# Altium schematic sheet ICM-20948.SchDoc
size A; SheetNumber: 6; SheetTotal: 6
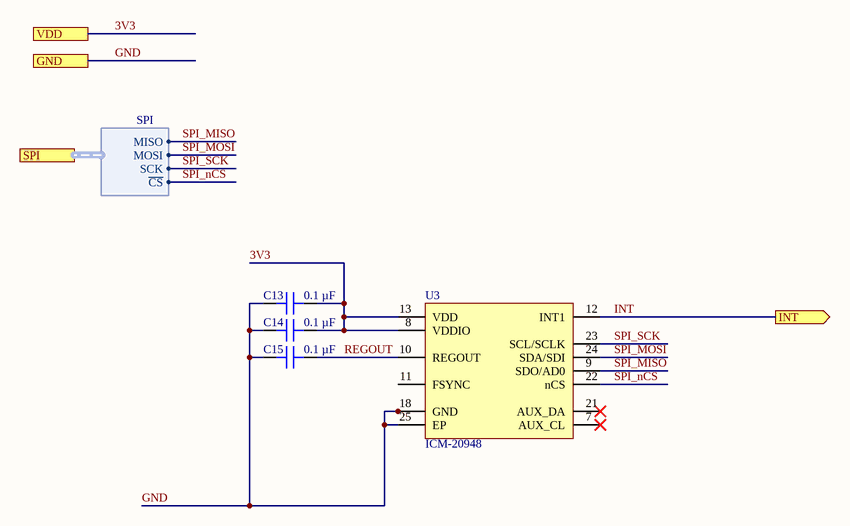
[diagram p0: ICM-20948.SchDoc]

## Parts
C13  0.1 µF  [CAP 0402_1005]
C14  0.1 µF  [CAP 0402_1005]
C15  0.1 µF  [CAP 0402_1005]
U3  ICM-20948  [ICM-20948]

## Ports
GND, INT (out), SPI (harness SPI), VDD

## Harnesses
SPI: MISO, SCK, MOSI, ~{CS}

## Nets
3V3: C13.1 C14.1 U3.8(VDDIO) U3.13(VDD) ; port VDD
GND: C13.2 C14.2 C15.2 U3.18(GND) U3.20(GND) U3.25(EP) ; port GND
INT: U3.12(INT1) ; port INT
REGOUT: C15.1 U3.10(REGOUT)
SPI_MISO: U3.9(SDO/AD0) ; port SPI.MISO
SPI_MOSI: U3.24(SDA/SDI) ; port SPI.MOSI
SPI_nCS: U3.22(nCS) ; port SPI.~{CS}
SPI_SCK: U3.23(SCL/SCLK) ; port SPI.SCK

Not connected (* = marked no-connect by the designer): U3 7(AUX_CL)* 11(FSYNC) 21(AUX_DA)*

## Library data of the parts
C13-C15 = C0402C104K4RACAUTO: CAP CER 0.1UF 16V X7R 0402; manufacturer: KEMET; Tolerance: ±10%; Part Number: C0402C104K4RACAUTO; Value: 0.1 µF; Applications: Automotive, Bypass, Decoupling; Capacitance: 0.1 µF; componentlink1description: Datasheet; componentlink1url: https://api.kemet.com/component-edge/download/specsheet/C0402C104K4RACAUTO.pdf; componentlink2description: DigiKey Link; componentlink2url: https://www.digikey.com/en/products/detail/kemet/C0402C104K4RACAUTO/3314827; Device Package: 0402 (1005 Metric); lastupdated: 8/14/2022 9:05:51 PM; Lifecycle Status: Active; Minimum Order: 1; Mounting Type: Surface Mount, MLCC; Operating Temperature: -55°C ~ 125°C; Package / Case: 0402 (1005 Metric); packaging: TapeAndReel; partid: 3024; Part Status: Active; price: 0.01; Ratings: AEC-Q200; series: SMD Auto X7R; Size / Dimension: 0.039" L x 0.020" W (1.00mm x 0.50mm); Supplier 1: DigiKey; Supplier Part Number 1: 399-6828-1-ND; Temperature Coefficient: X7R; Thickness (Max): 0.022" (0.55mm); Voltage - Rated: 16V
U3 = ICM-20948: 9-DOF IMU